# Altium schematic sheet USB-UART.SchDoc
size B; SheetNumber: 1; SheetTotal: 7
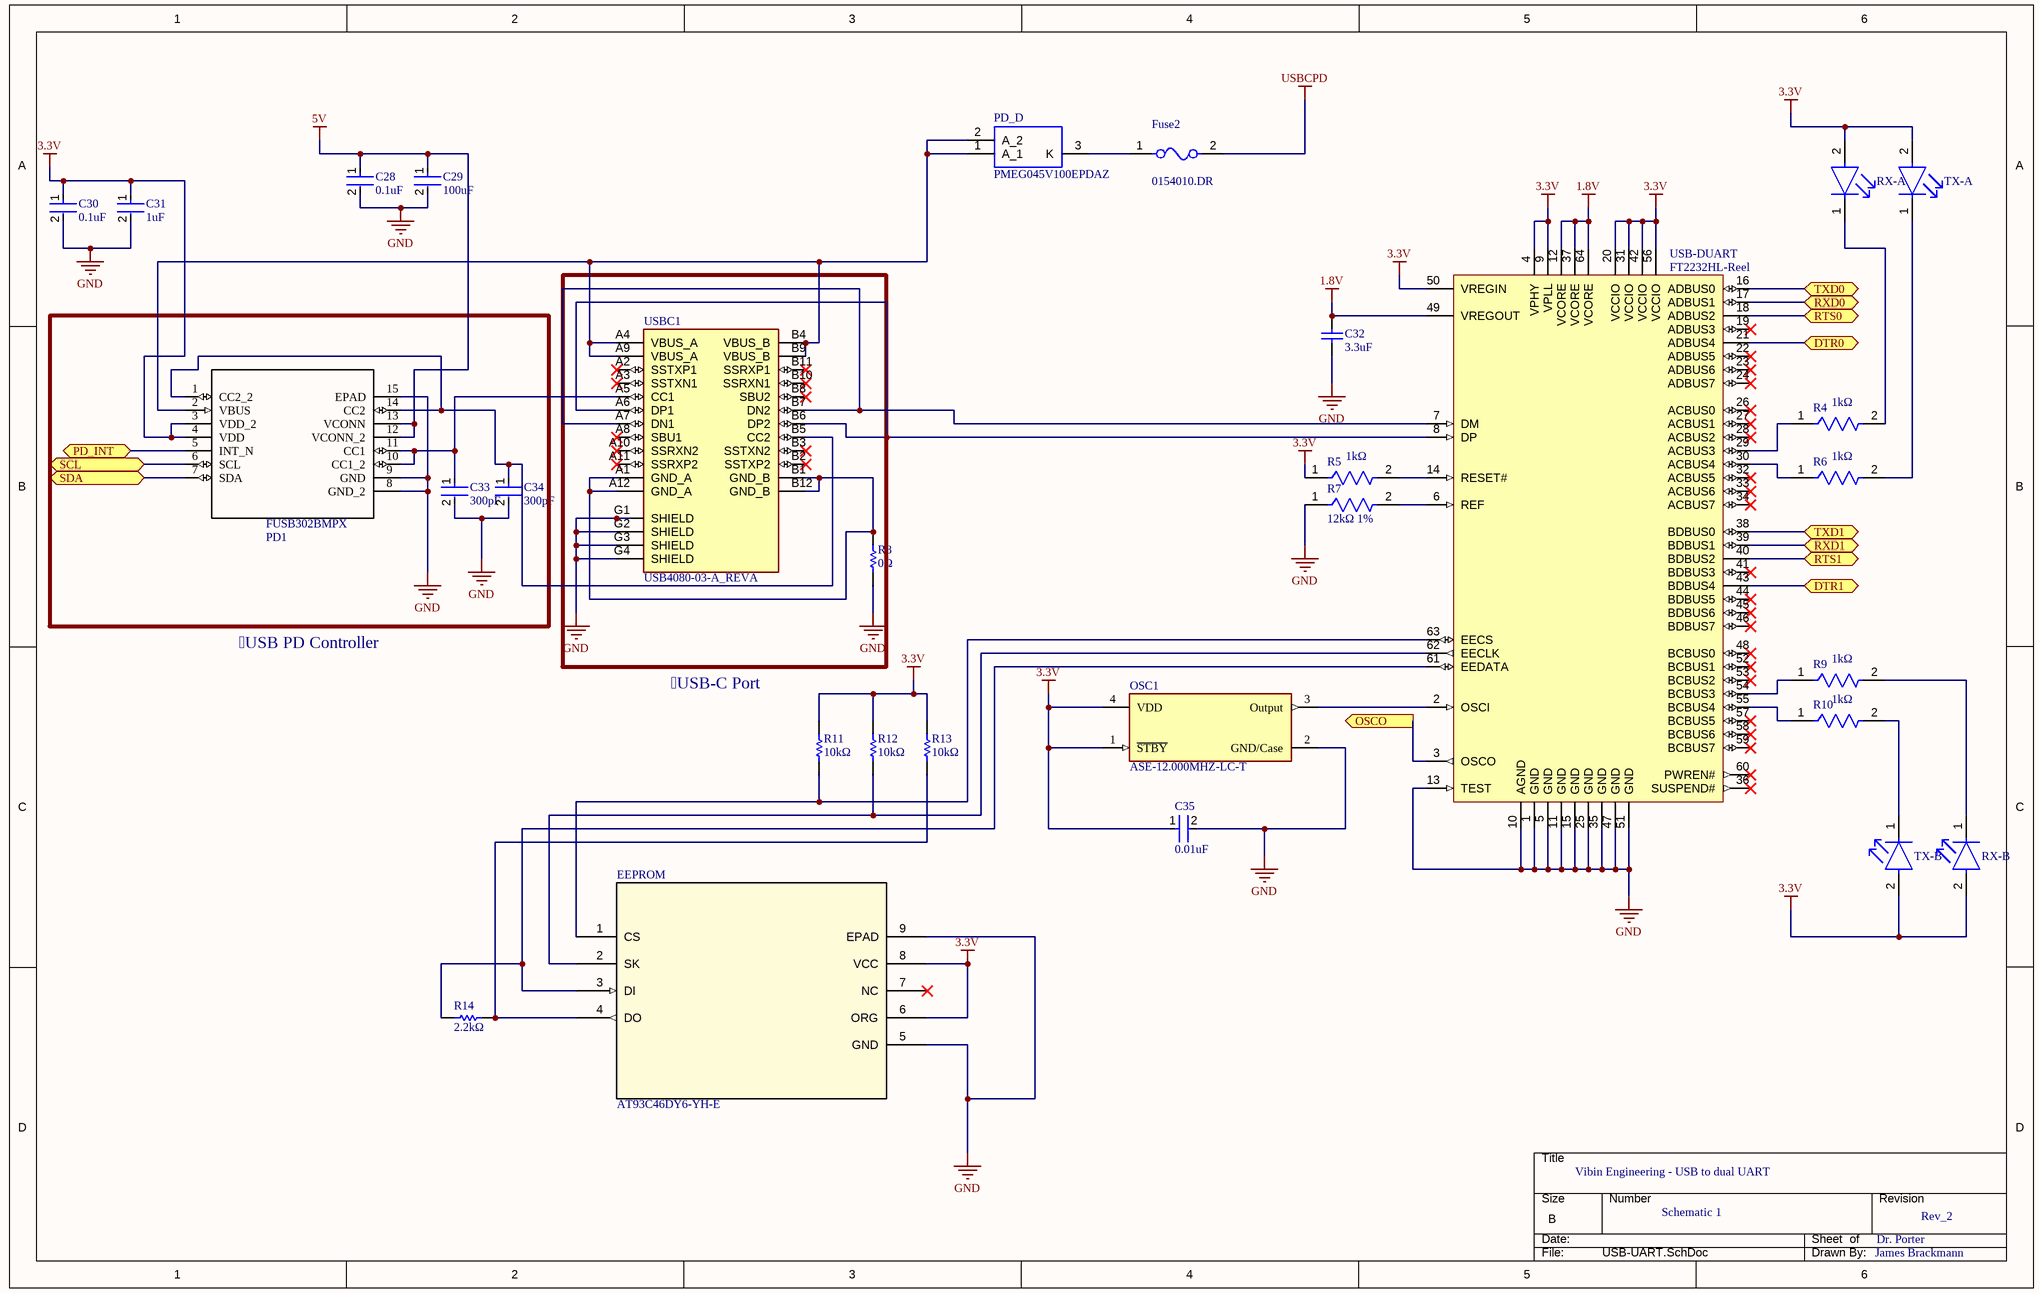
[diagram p0: USB-UART.SchDoc]

## Parts
C28  0.1uF  [FP-C0603-CJ-MFG]
C29  100uF  [FP-GRM32E-0_3-0_2-IPC_B]
C30  0.1uF  [FP-C0603-CJ-MFG]
C31  1uF  [FP-C2012-125-0_2-IPC_A]
C32  3.3uF  [CAPC1210(3225)190_N]
C33  300pF  [FP-C0603C-CF-MFG]
C34  300pF  [FP-C0603C-CF-MFG]
C35  0.01uF  [FP-GRM219-0_1-IPC_B]
EEPROM  AT93C46DY6-YH-E  [8Y6_MCH]
Fuse2  0154010.DR  [FP-0154-MFG]
OSC1  ASE-12.000MHZ-LC-T  [FP-ASE-MFG]
PD1  FUSB302BMPX  [*MLP14_2P5X2P5_ONS]
PD_D  PMEG045V100EPDAZ  [PMEG045V150EPDAZ]
R4  1kΩ  [FP-CRCW0603-e3-MFG]
R5  1kΩ  [FP-CRCW0603-e3-MFG]
R6  1kΩ  [FP-CRCW0603-e3-MFG]
R7  12kΩ 1%  [FP-CRCW0603-e3-IPC_A]
R8  0Ω  [RESC2013X50X30LL20T20]
R9  1kΩ  [FP-CRCW0603-e3-MFG]
R10  1kΩ  [FP-CRCW0603-e3-MFG]
R11  10kΩ  [RESC1005X40X25LL05T10]
R12  10kΩ  [RESC1005X40X25LL05T10]
R13  10kΩ  [RESC1005X40X25LL05T10]
R14  2.2kΩ  [RESC2013X60X40NL20T25]
RX-A  LTST-C190GKT  [FP-LTST-C190GKT-MFG]  (value not drawn)
RX-B  LTST-C190GKT  [FP-LTST-C190GKT-MFG]  (value not drawn)
TX-A  LTST-C190GKT  [FP-LTST-C190GKT-MFG]  (value not drawn)
TX-B  LTST-C190GKT  [FP-LTST-C190GKT-MFG]  (value not drawn)
USB-DUART  FT2232HL-Reel  [FTDI-LQFP-64_M]
USBC1  USB4080-03-A_REVA  [GCT_USB4080-03-A_REVA]

## Ports
DTR0 (bidir), DTR1 (bidir), OSCO (out), PD_INT (bidir), RTS0 (bidir), RTS1 (bidir), RXD0 (bidir), RXD1 (bidir), SCL (bidir), SDA (bidir), TXD0 (bidir), TXD1 (bidir)

## Nets
1.8V: C32.2 USB-DUART.12(VCORE) USB-DUART.37(VCORE) USB-DUART.49(VREGOUT) USB-DUART.64(VCORE)
3.3V: C30.1 C31.1 C35.1 EEPROM.6(ORG) EEPROM.8(VCC) OSC1.1(~{STBY}) OSC1.4(VDD) PD1.3(VDD_2) PD1.4(VDD) R5.1 R11.2 R12.2 R13.2 RX-A.2(A) RX-B.2(A) TX-A.2(A) TX-B.2(A) USB-DUART.4(VPHY) USB-DUART.9(VPLL) USB-DUART.20(VCCIO) USB-DUART.31(VCCIO) USB-DUART.42(VCCIO) USB-DUART.50(VREGIN) USB-DUART.56(VCCIO)
5V: C28.1 C29.1 PD1.12(VCONN_2) PD1.13(VCONN)
GND: C28.2 C29.2 C30.2 C31.2 C32.1 C33.2 C34.2 C35.2 EEPROM.5(GND) EEPROM.9(EPAD) OSC1.2(GND/Case) PD1.8(GND_2) PD1.9(GND) PD1.15(EPAD) R7.1 R8.1 USB-DUART.1(GND) USB-DUART.5(GND) USB-DUART.10(AGND) USB-DUART.11(GND) USB-DUART.13(TEST) USB-DUART.15(GND) USB-DUART.25(GND) USB-DUART.35(GND) USB-DUART.47(GND) USB-DUART.51(GND) USBC1.G1(SHIELD) USBC1.G2(SHIELD) USBC1.G3(SHIELD) USBC1.G4(SHIELD)
USBCPD: Fuse2.2
DTR0: USB-DUART.21(ADBUS4) ; port DTR0
DTR1: USB-DUART.43(BDBUS4) ; port DTR1
OSCO: USB-DUART.3(OSCO) ; port OSCO
PD_INT: PD1.5(INT_N) ; port PD_INT
RTS0: USB-DUART.18(ADBUS2) ; port RTS0
RTS1: USB-DUART.40(BDBUS2) ; port RTS1
RXD0: USB-DUART.17(ADBUS1) ; port RXD0
RXD1: USB-DUART.39(BDBUS1) ; port RXD1
SCL: PD1.6(SCL) ; port SCL
SDA: PD1.7(SDA) ; port SDA
TXD0: USB-DUART.16(ADBUS0) ; port TXD0
TXD1: USB-DUART.38(BDBUS0) ; port TXD1
NetC33_1: C33.1 PD1.10(CC1_2) PD1.11(CC1) USBC1.A5(CC1)
NetC34_1: C34.1 PD1.1(CC2_2) PD1.14(CC2) USBC1.B5(CC2)
NetEEPROM_1: EEPROM.1(CS) R11.1 USB-DUART.63(EECS)
NetEEPROM_2: EEPROM.2(SK) R12.1 USB-DUART.62(EECLK)
NetEEPROM_3: EEPROM.3(DI) R14.1 USB-DUART.61(EEDATA)
NetEEPROM_4: EEPROM.4(DO) R13.1 R14.2
NetFuse2_1: Fuse2.1 PD_D.3(K)
NetOSC1_3: OSC1.3(Output) USB-DUART.2(OSCI)
NetPD1_2: PD1.2(VBUS) PD_D.1(A_1) PD_D.2(A_2) USBC1.A4(VBUS_A) USBC1.A9(VBUS_A) USBC1.B4(VBUS_B) USBC1.B9(VBUS_B)
NetR4_1: R4.1 USB-DUART.29(ACBUS3)
NetR4_2: R4.2 RX-A.1(C)
NetR5_2: R5.2 USB-DUART.14(RESET#)
NetR6_1: R6.1 USB-DUART.30(ACBUS4)
NetR6_2: R6.2 TX-A.1(C)
NetR7_2: R7.2 USB-DUART.6(REF)
NetR8_2: R8.2 USBC1.A1(GND_A) USBC1.A12(GND_A) USBC1.B1(GND_B) USBC1.B12(GND_B)
NetR9_1: R9.1 USB-DUART.54(BCBUS3)
NetR9_2: R9.2 RX-B.1(C)
NetR10_1: R10.1 USB-DUART.55(BCBUS4)
NetR10_2: R10.2 TX-B.1(C)
NetUSB-DUART_7: USB-DUART.7(DM) USBC1.A7(DN1) USBC1.B7(DN2)
NetUSB-DUART_8: USB-DUART.8(DP) USBC1.A6(DP1) USBC1.B6(DP2)

Not connected (* = marked no-connect by the designer): EEPROM 7(NC)*; USB-DUART 19(ADBUS3)* 22(ADBUS5)* 23(ADBUS6)* 24(ADBUS7)* 26(ACBUS0)* 27(ACBUS1)* 28(ACBUS2)* 32(ACBUS5)* 33(ACBUS6)* 34(ACBUS7)* 36(SUSPEND#)* 41(BDBUS3)* 44(BDBUS5)* 45(BDBUS6)* 46(BDBUS7)* 48(BCBUS0)* 52(BCBUS1)* 53(BCBUS2)* 57(BCBUS5)* 58(BCBUS6)* 59(BCBUS7)* 60(PWREN#)*; USBC1 A2(SSTXP1)* A3(SSTXN1)* A8(SBU1)* A10(SSRXN2)* A11(SSRXP2)* B2(SSTXP2)* B3(SSTXN2)* B8(SBU2)* B10(SSRXN1)* B11(SSRXP1)*

## Notes on the sheet
- USB PD Controller
- USB-C Port
- Vibin Engineering - USB to dual UART
- Schematic 1
- Dr. Porter
- Rev_2
- James Brackmann
- DWG NO:
- REV:
- THIS DOCUMENT AND THE DATA DISCLOSED HEREIN OR
- HEREWITH IS THE PROPERTY OF ALTIUM LIMITED AND MAY
- BE FREELY DISTRIBUTED IN WHOLE. NO RIGHTS ARE
- RESERVED OR EXPRESS OR IMPLIED WARANTEE GIVEN.
- REVISION
- DESCRIPTION
- DATE
- APPROVED
- ENG:
- APPROVALS
- PROJECT
- DSN:
- CHK:
- REFERENCE DOCUMENTS
- PROJECT REVISION:
- TITLE
- DOCUMENT REVISION:
- DESIGN ITEM:
- BOM:
- FAB DWG:
- PCB DWG:
- ASSY DWG:
- SCALE:
- A2
- SIZE
- CAGE CODE
- FILE NAME
- DWG NO.
- SHEET
- OF
- REV

## Library data of the parts
C28 C30 = CMP-2006-03300-2: CAP CER 0.1UF 50V X7R 0603              C0603X104K5RACTU; Manufacturer: Kemet; Capacitance: 100nF; Material: Ceramic; Tolerance: 10%; Value: 100nF; Temperature Coefficient: 15%; Temperature Range High: +125°C; Temperature Range Low: -55°C; Manufacturer Part Number: C0603X104K5RACTU; Voltage: 50V; ComponentLink2Description: Datasheet; RoHS: TRUE; ComponentLink2URL: https://content.kemet.com/datasheets/KEM_C1013_X7R_FT-CAP_SMD.pdf; Device Class L3: Ceramic Capacitors; Device Class L2: Capacitors; Package: C0603-CJ; Height: 0.95mm; Device Class L1: Passive Components; Temperature Characteristic: X7R; Lead Free: Yes; Digikey Description: CAP CER 0.1UF 50V X7R 0603; Automotive: No; Mouser Description: Capacitor; Ceramic; Cap 0.1uF; Tol+10%; SMT; Flexible Termination; Vol-Rtg 50V; TR; Temperature: -55°C to +125°C; Octopart: https://octopart.com/c0603x104k5ractu-kemet-9145062; Category: Cap; Voltage Rating: 50V; Ipc Land Pattern Name: CAPC16080X80
C29 = CMP-06035-048205-1: Chip Multilayer Ceramic Capacitors for General Purpose, 1210, 100uF, X5R, 15%, 20%, 10V         GRM32ER61A107ME20L; Dissipation Factor: 0.035%; Packaging: Tape and Reel; Width: 2.5mm; Case/Package: 1210; Min Operating Temperature: -55°C; Depth: 2.5mm; Package Quantity: 1000; Case Code (Imperial): 1210; Voltage Rating: 10V; Dielectric Material: Ceramic; Length: 3.2mm; Lead Free: Lead Free; REACH SVHC: No SVHC; Mount: Surface Mount; Height: 2.5mm; Voltage Rating (DC): 10V; Dielectric: X5R; Thickness: 0.106inch; Weight: 0.00388oz; Material: Ceramic; Termination: SMD/SMT; Tolerance: 20%; Case Code (Metric): 3225; Voltage: 10V; Max Operating Temperature: 85°C; Capacitance: 100uF
C31 = CMP-08246-005389-1: Multilayer Ceramic Capacitors 1μF ±10% 25V X5R SMD 0805           C2012X5R1E105K125AA; Min Operating Temperature: -55°C; Construction: Flat; Package Quantity: 2000; Height: 1.25mm; Resistor Type: Ceramic; Case/Package: 0805; Depth: 1.25mm; Case Code (Metric): 2012; Weight: 0.000194oz; REACH SVHC: No SVHC; Dielectric: X5R; Max Operating Temperature: 85°C; Number of Pins: 2; Thickness: 0.057inch; RoHS Compliant: Yes; Radiation Hardening: No; Lead Free: Lead Free; Case Code (Imperial): 0805; Length: 2mm; Voltage Rating: 25V; Mount: Surface Mount; Voltage Rating (DC): 25V; Packaging: Tape and Reel; Dielectric Material: Ceramic; Termination: SMD/SMT; Voltage: 25V; Capacitance: 1uF; Tolerance: 10%; Series: C; Width: 0.049inch
C32 = CMP-1038-02125-1: CAP 3.3uF 50V ±10% 1210 (3225 Metric) Thickness 1.9mm SMD; Case-EIA: 1210; Case-Metric: 3225; Tolerance: Â±10%; Technology: SMT; Max Thickness: 1.9 mm; Value: 3.3uF; Rated Voltage: 50 V
C33 = CMP-1035-01549-3: CAP CER 300PF 50V 5% NP0 0603        C0603C301J5GACTU; Manufacturer: KEMET; Tolerance: 0.05; Automotive Grade: Grade 1; Temperature Coefficient: 30ppm/°C; Material: Ceramic; Temperature Characteristic: C0G; Temperature: -55°C to +125°C; ComponentLink2URL: https://api.kemet.com/component-edge/download/datasheet/C0603C100J5GACAUTO.pdf; Device Class L2: Capacitors; Lead Free: Yes; Octopart: https://octopart.com/c0603c301j5gactu-kemet-9143916; Temperature Range High: +125°C; Automotive: Yes; RoHS: TRUE; Temperature Range Low: -55°C; Digikey Description: CAP CER 300PF 50V 5% NP0 0603; ComponentLink2Description: Datasheet; Device Class L3: Ceramic Capacitors; Category: Cap; Manufacturer Part Number: C0603C301J5GACTU; Voltage Rating: 50 V; Value: 300 pF; Capacitance: 300 pF; Package: C0603C-CF; Mouser Description: Multilayer Ceramic Capacitors MLCC - SMD/SMT 50volts 300pF C0G 5%; Device Class L1: Passive Components; Height: 0.87mm
C34 = CMP-1035-01549-3: CAP CER 300PF 50V 5% NP0 0603          C0603C301J5GACTU; Manufacturer: KEMET; Tolerance: 0.05; Automotive Grade: Grade 1; Temperature Coefficient: 30ppm/°C; Material: Ceramic; Temperature Characteristic: C0G; Temperature: -55°C to +125°C; ComponentLink2URL: https://api.kemet.com/component-edge/download/datasheet/C0603C100J5GACAUTO.pdf; Device Class L2: Capacitors; Lead Free: Yes; Octopart: https://octopart.com/c0603c301j5gactu-kemet-9143916; Temperature Range High: +125°C; Automotive: Yes; RoHS: TRUE; Temperature Range Low: -55°C; Digikey Description: CAP CER 300PF 50V 5% NP0 0603; ComponentLink2Description: Datasheet; Device Class L3: Ceramic Capacitors; Category: Cap; Manufacturer Part Number: C0603C301J5GACTU; Voltage Rating: 50 V; Value: 300 pF; Capacitance: 300 pF; Package: C0603C-CF; Mouser Description: Multilayer Ceramic Capacitors MLCC - SMD/SMT 50volts 300pF C0G 5%; Device Class L1: Passive Components; Height: 0.87mm
C35 = CMP-2007-00135-2: Chip Multilayer Ceramic Capacitors for General Purpose, 0805, 10000pF, C0G, 30ppm/°C, 5%, 50V; Insulation Resistance: 10GR; Capacitance: 10nF; Max Operating Temperature: 125°C; Height: 0.85mm; Voltage: 50V; Dielectric Material: Ceramic; Voltage Rating: 50V; Dielectric: C0G; Thickness: 0.037inch; REACH SVHC: No SVHC; Lead Free: Lead Free; Depth: 1.25mm; Min Operating Temperature: -55°C; Package Quantity: 1; Packaging: Tape and Reel; Case Code (Imperial): 0805; Case/Package: 0805; Mount: Surface Mount; Width: 0.049inch; Case Code (Metric): 2012; Length: 2mm; Termination: SMD/SMT; Material: Ceramic; Tolerance: 5%; Temperature Coefficient: 30ppm/°C; Number of Pins: 2; Voltage Rating (DC): 50V; Radiation Hardening: No
EEPROM = AT93C46DY6-YH-E: No Description Available; Mfr_Name: Microchip; Copyright: Copyright (C) 2022 Ultra Librarian. All rights reserved.; Manufacturer_Part_Number: AT93C46DY6-YH-E; Digi-Key_Part_Number_1: AT93C46DY6-YH-ECT-ND; Digi-Key_Part_Number_2: AT93C46DY6-YH-EDKR-ND; Digi-Key_Part_Number_3: AT93C46DY6-YH-ETR-ND; RefDes: RefDes; Type: DEV
Fuse2 = CMP-2000-05598-2: FUSE BRD MNT 10A 125VAC/VDC SMD    0154010.DR; Manufacturer: Littelfuse Inc; Fuse Blow Speed: Fast; Max Fuse Dc Voltage: 125V; Digikey Description: FUSE BRD MNT 10A 125VAC/VDC SMD; Mouser Description: Surface Mount Fuses Fuse with Holder 10A FAST OMNI BLOK 154; ComponentLink2Description: Datasheet; Height: 3.81mm; Automotive: No; Category: Fuse; Device Class L3: unset; Package: 0154; Temperature Range High: +125°C; RoHS: TRUE; Temperature Range Low: -55°C; Temperature: -55°C to +125°C; Manufacturer Part Number: 0154010.DR; Fuse Current: 10A; Device Class L2: Fuses; Device Class L1: Circuit Protection; Max Fuse Ac Voltage: 125V; Voltage Rating: 125V; ComponentLink2URL: https://www.littelfuse.com/~/media/electronics/datasheets/fuses/littelfuse_fuse_154_154t_154l_154tl_datasheet.pdf.pdf; Lead Free: Yes; Octopart: https://octopart.com/0154010.dr-littelfuse-565890
OSC1 = CMP-27762-006076-1: XTAL Oscillator 12MHz ±50ppm CMOS 3.3V 4-SMD 3.2mm x 2.5mm; Load Capacitance: 15pF; Min Supply Voltage: 3.135V; Max Supply Current: 7mA; Max Supply Voltage: 3.465V; Series: ASE; Number of Pins: 4; Operating Frequency: 12 MHz; Operating Supply Voltage: 3.3V; Packaging: Tape and Reel; Package Quantity: 1000; Lead Free: Lead Free; REACH SVHC: No SVHC; Max Operating Temperature: 85°C; Frequency: 12MHz; Height: 0.047inch; Frequency Stability: 50ppm; Length: 3.2mm; Width: 0.098inch; Radiation Hardening: No; Mount: Surface Mount; Termination: SMD/SMT; Depth: 2.5mm; Case/Package: SMD/SMT; Min Operating Temperature: -40°C
PD1 = FUSB302BMPX: USB Controller USB 3.1 USB Interface 14-MLP (2.5x2.5)          FUSB302BMPX; MF: ON Semiconductor; Purchase-URL: https://pricing.snapeda.com/search/part/FUSB302BMPX/?ref=eda; Package: WQFN-14 ON Semiconductor; MP: FUSB302BMPX; SnapEDA_Link: https://www.snapeda.com/parts/FUSB302BMPX/Onsemi/view-part/?ref=snap; Availability: In Stock; Price: None; Check_prices: https://www.snapeda.com/parts/FUSB302BMPX/Onsemi/view-part/?ref=eda; Value: *
PD_D = PMEG045V100EPDAZ: Diode Schottky 45V 10A Surface Mount CFP15         PMEG045V100EPDAZ; MF: Nexperia USA; Value: *; Check_prices: https://www.snapeda.com/parts/PMEG045V100EPDAZ/Nexperia/view-part/666110/?ref=eda; MP: PMEG045V100EPDAZ; Purchase-URL: https://pricing.snapeda.com/search/part/PMEG045V100EPDAZ/?ref=eda; Price: None; Availability: In Stock; Package: CFP15-3 Nexperia USA Inc.; SnapEDA_Link: https://www.snapeda.com/parts/PMEG045V100EPDAZ/Nexperia/view-part/666110/?ref=snap
R4-R6 R9 R10 = CMP-1666-00003-5: RES Thick Film, 1kΩ, 1%, 0.1W, 100ppm/°C, 0603; Max Power Dissipation: 100mW; Voltage Rating: 75V; Resistance: 1kR; Max Operating Temperature: 155°C; Number of Pins: 2; Case Code (Imperial): 0603; Width: 0.033inch; Power Rating: 100mW; Number of Terminations: 2; Package Quantity: 10; Weight: 7.1E-05oz; Tolerance: 1%; Temperature Coefficient: 100ppm/°C; Military Standard: Not; Mount: Surface Mount; Voltage Rating (DC): 75V; Depth: 0.85mm; Composition: Thick Film; Radiation Hardening: No; Termination: SMD/SMT; Length: 1.55mm; Case Code (Metric): 1608; Contact Plating: Tin; Min Operating Temperature: -55°C; Packaging: Tape and Reel; Height: 0.45mm; Lead Free: Lead Free; Case/Package: 0603; Features: Automotive AEC-Q200
R7 = CMP-2000-03877-2: RES Thick Film, 12kΩ, 1%, 0.1W, 100ppm/°C, 0603; Resistance: 12kR; Voltage Rating: 75V; Power Rating: 100mW; Termination: SMD/SMT; Case Code (Metric): 1608; Max Operating Temperature: 155°C; Depth: 0.85mm; Width: 0.033inch; Military Standard: Not; Composition: Thick Film; Features: Automotive AEC-Q200; Lead Free: Lead Free; Weight: 7.1E-05oz; Mount: Surface Mount; Height: 0.45mm; Min Operating Temperature: -55°C; Tolerance: 1%; Case/Package: 0603; Temperature Coefficient: 100ppm/°C; Contact Plating: Tin; Voltage Rating (DC): 75V; Length: 1.55mm; Packaging: Tape and Reel; Case Code (Imperial): 0603; Max Power Dissipation: 100mW; Package Quantity: 10; Radiation Hardening: No; Number of Terminations: 2
R8 = CMP-2001-04896-1: 0 kΩ for Ground of USB-C to ground plane; Manufacturer: Vishay Dale; Part Number: CRCW08050000Z0EA
R11-R13 = CMP-2002-07353-1: RC0402FR-0710KL; Manufacturer: Yageo / Phycomp; Part Number: RC0402FR-0710KL
R14 = CMP-2001-00686-1: ERA-6AED222V; Manufacturer: Panasonic; Part Number: ERA-6AED222V
RX-A RX-B TX-A TX-B = CMP-22017-000005-2: LED GREEN CLEAR CHIP SMD       LTST-C190GKT; Dominant Wavelength: 569nm; Reverse Voltage: 5V; Lens Color: Colorless; Viewing Angle: 130°; Voltage: 2V; Forward Current: 30mA; Power Dissipation: 100mW; Luminous Intensity: 6mcd; Number of LEDs: 1; Forward Voltage: 2.1V; Wavelength: 565nm; Test Current: 10mA; Min Operating Temperature: -55°C; Lens Style: Clear; Mount: Surface Mount; Width: 0.8mm; Packaging: Tape and Reel; Lens Transparency: Clear; Case Code (Metric): 1608; Depth: 0.8mm; Case Code (Imperial): 0603; Case/Package: 0603; Number of Pins: 2; Max Operating Temperature: 85°C; Lead Free: Lead Free; Number of Elements: 1; Length: 1.6mm; Height: 0.8mm; Package Quantity: 1; Power Rating: 100mW; Radiation Hardening: No; Illumination Color: Green; Color: Green
USB-DUART = CMP-0078-00023-3: Dual High Speed USB To Multipurpose UART/FIFO IC, 64-pin LQFP, Tape and Reel; Manufacturer: FTDI; DatasheetVersion: ver 2.21, Jun-2012; ComponentLink1URL: http://www.ftdichip.com/; PartNumber: FT2232HL-Reel; ComponentLink2Description: Datasheet; RevisionNote: DatasheetVersion updated to 2.21 Jun-2012; PackageVersion: Jun-12; ComponentLink1Description: Manufacturer URL; ComponentLink2URL: http://www.ftdichip.com/Support/Documents/DataSheets/ICs/DS_FT2232H.pdf; PackageReference: LQFP-64; PackageDescription: 64-Pin Thin Quad Flat Pack, 10 x 10 x 1.4 mm Body, 0.5 mm Pitch; Manufacturer Part Number: FT2232HL-REEL
USBC1 = USB4080-03-A_REVA: USB-C (USB TYPE-C) USB 3.2 Gen 2 (USB 3.1 Gen 2, Superspeed + (USB 3.1)) Receptacle Connector 24 Position Surface Mount, Right Angle; Through Hole; MF: Global Connector Technology; Package: None; Check_prices: https://www.snapeda.com/parts/USB4080-03-A/Global+Connector+Technology/view-part/?ref=eda; Value: *; MP: USB4080-03-A; Availability: In Stock; SnapEDA_Link: https://www.snapeda.com/parts/USB4080-03-A/Global+Connector+Technology/view-part/?ref=snap; Purchase-URL: https://pricing.snapeda.com/search/part/USB4080-03-A/?ref=eda; Price: None